# EAGLE design CircuitoClasificadorv1 (EAGLE 9.6.2)
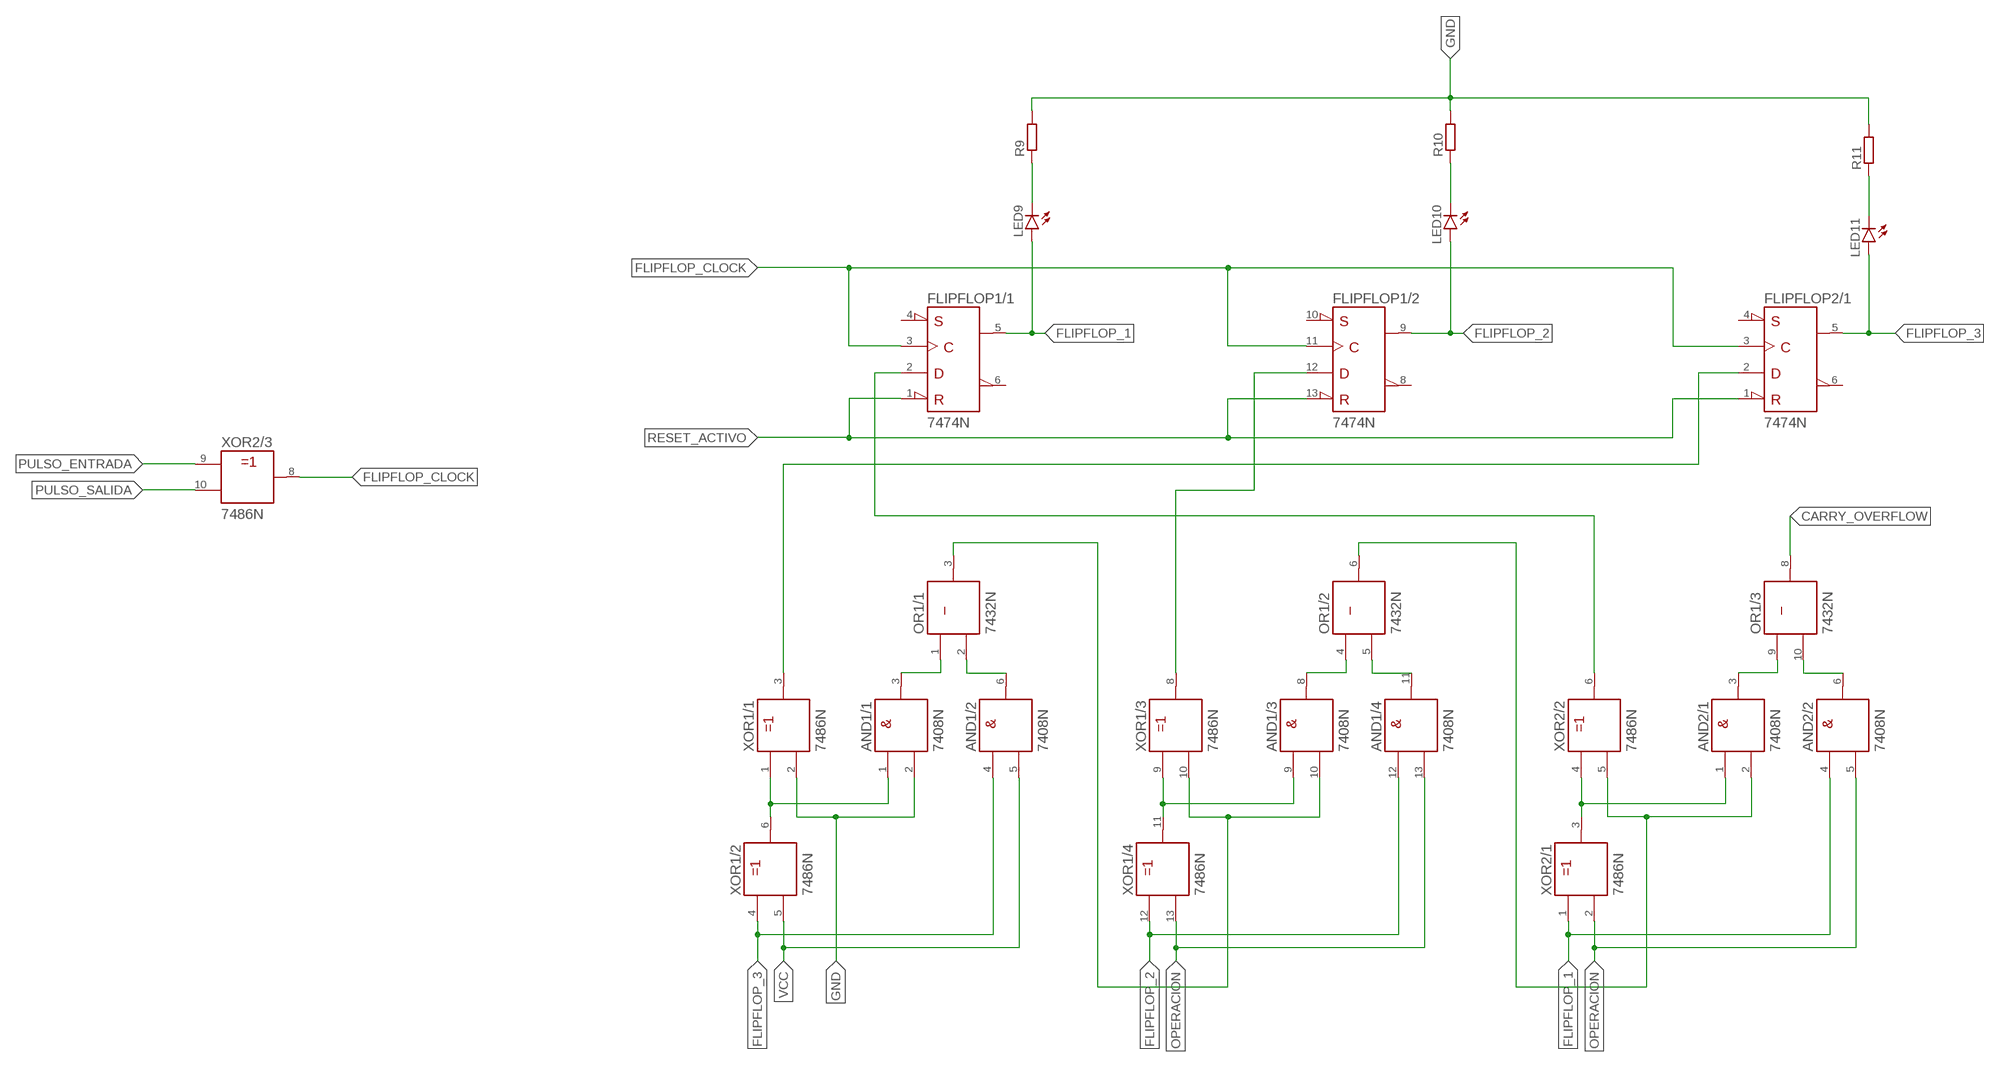
[diagram p0: schematic, sheet 1, part 1 of 2]
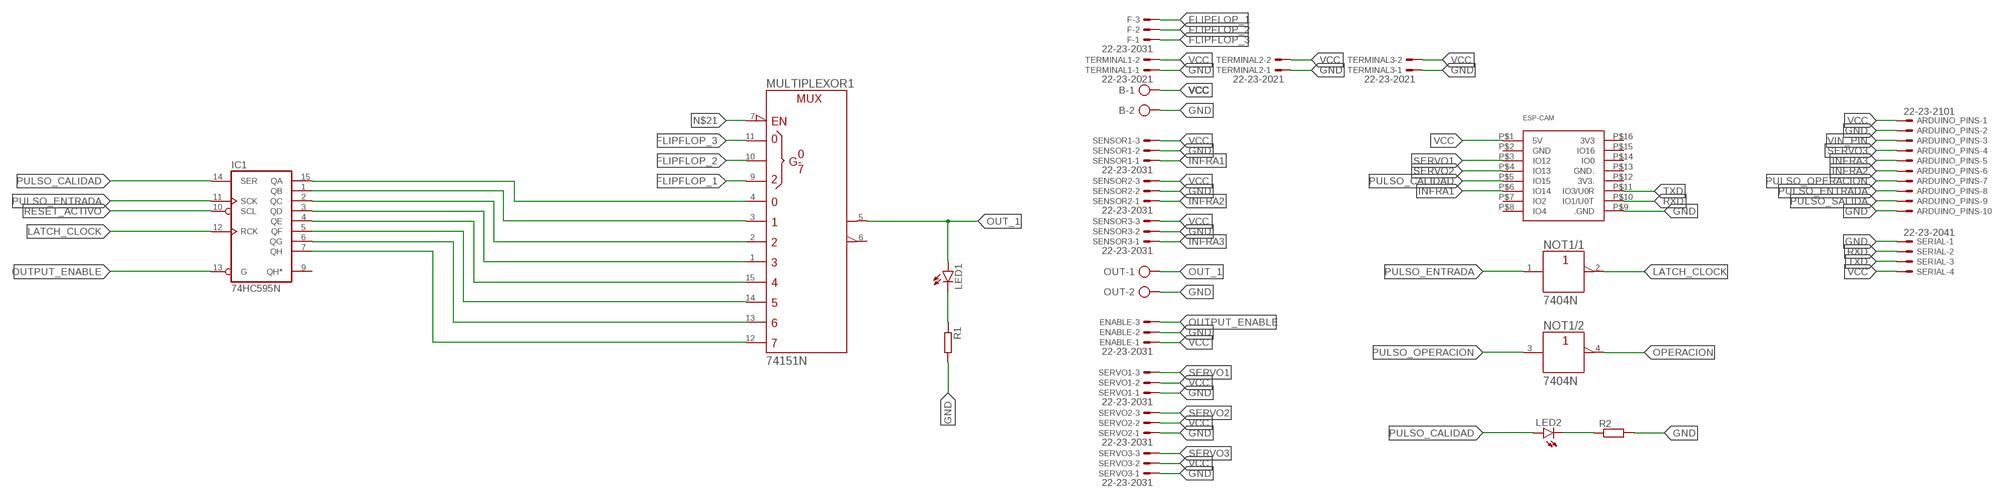
[diagram p1: schematic, sheet 1, part 2 of 2]

## Parts
AND1  7408N  [DIL14]
AND2  7408N  [DIL14]
ARDUINO_PINS  22-23-2101  [22-23-2101]
B  AK500/2  [AK500/2]
ENABLE  22-23-2031  [22-23-2031]
ESP-CAM  ESP32-CAM  [ESP32-CAM]
F  22-23-2031  [22-23-2031]
FLIPFLOP1  7474N  [DIL14]
FLIPFLOP2  7474N  [DIL14]
IC1  74HC595N  [DIL16]
LED1  LED5MM  [LED5MM]
LED2  LED5MM  [LED5MM]
LED9  LED5MM  [LED5MM]
LED10  LED5MM  [LED5MM]
LED11  LED5MM  [LED5MM]
MULTIPLEXOR1  74151N  [DIL16]
NOT1  7404N  [DIL14]
OR1  7432N  [DIL14]
OUT  AK500/2-H  [AK500/2-H]
R1  R-EU_0207/10  [0207/10]
R2  R-EU_0207/10  [0207/10]
R9  R-EU_0207/10  [0207/10]
R10  R-EU_0207/10  [0207/10]
R11  R-EU_0207/10  [0207/10]
SENSOR1  22-23-2031  [22-23-2031]
SENSOR2  22-23-2031  [22-23-2031]
SENSOR3  22-23-2031  [22-23-2031]
SERIAL  22-23-2041  [22-23-2041]
SERVO1  22-23-2031  [22-23-2031]
SERVO2  22-23-2031  [22-23-2031]
SERVO3  22-23-2031  [22-23-2031]
TERMINAL1  22-23-2021  [22-23-2021]
TERMINAL2  22-23-2021  [22-23-2021]
TERMINAL3  22-23-2021  [22-23-2021]
XOR1  7486N  [DIL14]
XOR2  7486N  [DIL14]

## Nets
CARRY_OVERFLOW: OR1.8(/3:Y)
FLIPFLOP_1: AND2.4(/2:A) F.3 FLIPFLOP1.5(/1:Q) LED9.A MULTIPLEXOR1.9(C) XOR2.1(/1:A)
FLIPFLOP_2: AND1.12(/4:A) F.2 FLIPFLOP1.9(/2:Q) LED10.A MULTIPLEXOR1.10(B) XOR1.12(/4:A)
FLIPFLOP_3: AND1.4(/2:A) F.1 FLIPFLOP2.5(/1:Q) LED11.A MULTIPLEXOR1.11(A) XOR1.4(/2:A)
FLIPFLOP_CLOCK: FLIPFLOP1.3(/1:CLK) FLIPFLOP1.11(/2:CLK) FLIPFLOP2.3(/1:CLK) XOR2.8(/3:Y)
GND: AND1.2(/1:B) ARDUINO_PINS.2 ARDUINO_PINS.10 B.2 ENABLE.2 ESP-CAM.P$9(.GND) OUT.2 R1.2 R2.2 R9.2 R10.2 R11.2 SENSOR1.2 SENSOR2.2 SENSOR3.2 SERIAL.1 SERVO1.1 SERVO2.1 SERVO3.1 TERMINAL1.1 TERMINAL2.1 TERMINAL3.1 XOR1.2(/1:B)
INFRA1: ESP-CAM.P$6(IO14) SENSOR1.1
INFRA2: ARDUINO_PINS.6 SENSOR2.1
INFRA3: ARDUINO_PINS.5 SENSOR3.1
LATCH_CLOCK: IC1.12(RCK) NOT1.2(/1:Y)
N$1: AND1.1(/1:A) XOR1.1(/1:A) XOR1.6(/2:Y)
N$2: LED2.K(C) R2.1
N$3: LED1.K(C) R1.1
N$4: AND1.6(/2:Y) OR1.2(/1:B)
N$5: FLIPFLOP2.2(/1:D) XOR1.3(/1:Y)
N$6: AND1.3(/1:Y) OR1.1(/1:A)
N$7: AND1.8(/3:Y) OR1.4(/2:A)
N$8: AND1.11(/4:Y) OR1.5(/2:B)
N$9: AND1.9(/3:A) XOR1.9(/3:A) XOR1.11(/4:Y)
N$10: AND1.10(/3:B) OR1.3(/1:Y) XOR1.10(/3:B)
N$11: AND2.3(/1:Y) OR1.9(/3:A)
N$14: AND2.6(/2:Y) OR1.10(/3:B)
N$15: AND2.1(/1:A) XOR2.3(/1:Y) XOR2.4(/2:A)
N$18: AND2.2(/1:B) OR1.6(/2:Y) XOR2.5(/2:B)
N$19: FLIPFLOP1.12(/2:D) XOR1.8(/3:Y)
N$20: FLIPFLOP1.2(/1:D) XOR2.6(/2:Y)
N$21: MULTIPLEXOR1.7(!G)
N$24: IC1.15(QA) MULTIPLEXOR1.4(D0)
N$25: IC1.1(QB) MULTIPLEXOR1.3(D1)
N$26: IC1.2(QC) MULTIPLEXOR1.2(D2)
N$27: IC1.3(QD) MULTIPLEXOR1.1(D3)
N$28: IC1.4(QE) MULTIPLEXOR1.15(D4)
N$29: IC1.5(QF) MULTIPLEXOR1.14(D5)
N$30: IC1.6(QG) MULTIPLEXOR1.13(D6)
N$31: IC1.7(QH) MULTIPLEXOR1.12(D7)
N$35: LED11.K(C) R11.1
N$36: LED10.K(C) R10.1
N$37: LED9.K(C) R9.1
OPERACION: AND1.13(/4:B) AND2.5(/2:B) NOT1.4(/2:Y) XOR1.13(/4:B) XOR2.2(/1:B)
OUT_1: LED1.A MULTIPLEXOR1.5(Y) OUT.1
OUTPUT_ENABLE: ENABLE.3 IC1.13(G)
PULSO_CALIDAD: ESP-CAM.P$5(IO15) IC1.14(SER) LED2.A
PULSO_ENTRADA: ARDUINO_PINS.8 IC1.11(SCK) NOT1.1(/1:A) XOR2.9(/3:A)
PULSO_OPERACION: ARDUINO_PINS.7 NOT1.3(/2:A)
PULSO_SALIDA: ARDUINO_PINS.9 XOR2.10(/3:B)
RESET_ACTIVO: FLIPFLOP1.1(/1:!CLR) FLIPFLOP1.13(/2:!CLR) FLIPFLOP2.1(/1:!CLR) IC1.10(SCL)
RXD: ESP-CAM.P$10(IO1/U0T) SERIAL.2
SERVO1: ESP-CAM.P$3(IO12) SERVO1.3
SERVO2: ESP-CAM.P$4(IO13) SERVO2.3
SERVO3: ARDUINO_PINS.4 SERVO3.3
TXD: ESP-CAM.P$11(IO3/U0R) SERIAL.3
VCC: AND1.5(/2:B) ARDUINO_PINS.1 B.1 ENABLE.1 ESP-CAM.P$1(5V) SENSOR1.3 SENSOR2.3 SENSOR3.3 SERIAL.4 SERVO1.2 SERVO2.2 SERVO3.2 TERMINAL1.2 TERMINAL2.2 TERMINAL3.2 XOR1.5(/2:B)
VIN_PIN: ARDUINO_PINS.3
Unconnected: AND2.8(/3:Y) AND2.9(/3:A) AND2.10(/3:B) AND2.11(/4:Y) AND2.12(/4:A) AND2.13(/4:B) ESP-CAM.P$2(GND) ESP-CAM.P$7(IO2) ESP-CAM.P$8(IO4) ESP-CAM.P$12(3V3.) ESP-CAM.P$13(GND.) ESP-CAM.P$14(IO0) ESP-CAM.P$15(IO16) ESP-CAM.P$16(3V3) FLIPFLOP1.4(/1:!PRE) FLIPFLOP1.6(/1:!Q) FLIPFLOP1.8(/2:!Q) FLIPFLOP1.10(/2:!PRE) FLIPFLOP2.4(/1:!PRE) FLIPFLOP2.6(/1:!Q) FLIPFLOP2.8(/2:!Q) FLIPFLOP2.9(/2:Q) FLIPFLOP2.10(/2:!PRE) FLIPFLOP2.11(/2:CLK) FLIPFLOP2.12(/2:D) FLIPFLOP2.13(/2:!CLR) IC1.9(QH*) MULTIPLEXOR1.6(W) NOT1.5(/3:A) NOT1.6(/3:Y) NOT1.8(/4:Y) NOT1.9(/4:A) NOT1.10(/5:Y) NOT1.11(/5:A) NOT1.12(/6:Y) NOT1.13(/6:A) OR1.11(/4:Y) OR1.12(/4:A) OR1.13(/4:B) XOR2.11(/4:Y) XOR2.12(/4:A) XOR2.13(/4:B)

## Power pins joined to a net without a drawn wire
+UB: AND1.14(/+UB:+UB) AND2.14(/+UB:+UB) FLIPFLOP1.14(/+UB:+UB) FLIPFLOP2.14(/+UB:+UB) MULTIPLEXOR1.16(+UB) NOT1.14(/+UB:+UB) OR1.14(/+UB:+UB) XOR1.14(/+UB:+UB) XOR2.14(/+UB:+UB)
-UB: AND1.7(/-UB:-UB) AND2.7(/-UB:-UB) FLIPFLOP1.7(/-UB:-UB) FLIPFLOP2.7(/-UB:-UB) MULTIPLEXOR1.8(-UB) NOT1.7(/-UB:-UB) OR1.7(/-UB:-UB) XOR1.7(/-UB:-UB) XOR2.7(/-UB:-UB)
GND: IC1.8(GND)
VCC: IC1.16(VCC)

## Library data of the parts
AND1 AND2 = 74ttl-din:74*08: Quad 2-input AND gate
ARDUINO_PINS = con-molex:22-23-2101: .100" (2.54mm) Center Header - 10 Pin; MF: MOLEX; MPN: 22-23-2101; OC_FARNELL: 1756828; OC_NEWARK: 94C0765
B = con-ptr500:AK500/2: CONNECTOR; OC_FARNELL: unknown; OC_NEWARK: unknown
ENABLE F SENSOR1-SENSOR3 SERVO1-SERVO3 = con-molex:22-23-2031: .100" (2.54mm) Center Header - 3 Pin; MF: MOLEX; MPN: 22-23-2031; OC_FARNELL: 1462950; OC_NEWARK: 30C0862
ESP-CAM = ESP32-CAM:ESP32-CAM: Check availability <https://pricing.snapeda.com/parts/ESP32-CAM/AI-Thinker/view-part?ref=eda>; AVAILABILITY: In Stock; DESCRIPTION: ESP32 ESP32 Transceiver; 802.11 a/b/g/n (Wi-Fi, WiFi, WLAN), Bluetooth® Smart 4.x Low Energy (BLE) Evaluation Board; MF: AI-Thinker; MP: ESP32-CAM; PACKAGE: None; PRICE: None; PURCHASE-URL: https://pricing.snapeda.com/search/part/ESP32-CAM/?ref=eda
FLIPFLOP1 FLIPFLOP2 = 74ttl-din:74*74: Dual D type positive edge triggered FLIP FLOP, preset and clear
IC1 = 74xx-eu:74*595: 8-bit SHIFT REGISTER, output latch
LED1 LED2 LED9-LED11 = led:LED: LED OSRAM: - CHIPLED LG R971, LG N971, LY N971, LG Q971, LY Q971, LO R971, LY R971 LH N974, LH R974 LS Q976, LO Q976, LY Q976 LO Q996 - Hyper CHIPLED LW Q18S LB Q993, LB Q99A, LB R99A - SideLED LS A670, LO A670, LY A670, LG A670, LP A670 LB A673, LV A673, LT A673, LW A673 LH A674 LY A675 LS A676, LA A676, LO A676, LY A676, LW A676 LS A679, LY A679, LG A679 - Hyper Micro SIDELED® LS Y876, LA Y876, LO Y876, LY Y876 LT Y87S - SmartLED LW L88C, LW L88S LB L89C, LB L89S, LG L890 LS L89K, LO L89K, LY L89K LS L896, LA L896, LO L896, LY L896 - TOPLED LS T670, LO T670, LY T670, LG T670, LP T670 LSG T670, LSP T670, LSY T670, LOP T670, LYG T670 LG T671, LOG T671, LSG T671 LB T673, LV T673, LT T673, LW T673 LH T674 LS T676, LA T676, LO T676, LY T676, LB T676, LH T676, LSB T676, LW T676 LB T67C, LV T67C, LT T67C, LS T67K, LO T67K, LY T67K, LW E67C LS E67B, LA E67B, LO E67B, LY E67B, LB E67C, LV E67C, LT E67C LW T67C LS T679, LY T679, LG T679 LS T770, LO T770, LY T770, LG T770, LP T770 LB T773, LV T773, LT T773, LW T773 LH T774 LS E675, LA E675, LY E675, LS T675 LS T776, LA T776, LO T776, LY T776, LB T776 LHGB T686 LT T68C, LB T68C - Hyper Mini TOPLED® LB M676 - Mini TOPLED Santana® LG M470 LS M47K, LO M47K, LY M47K Source: http://www.osram.convergy.de LUXEON: - LUMILED® LXK2-PW12-R00, LXK2-PW12-S00, LXK2-PW14-U00, LXK2-PW14-V00 LXK2-PM12-R00, LXK2-PM12-S00, LXK2-PM14-U00 LXK2-PE12-Q00, LXK2-PE12-R00, LXK2-PE12-S00, LXK2-PE14-T00, LXK2-PE14-U00 LXK2-PB12-K00, LXK2-PB12-L00, LXK2-PB12-M00, LXK2-PB14-N00, LXK2-PB14-P00, LXK2-PB14-Q00 LXK2-PR12-L00, LXK2-PR12-M00, LXK2-PR14-Q00, LXK2-PR14-R00 LXK2-PD12-Q00, LXK2-PD12-R00, LXK2-PD12-S00 LXK2-PH12-R00, LXK2-PH12-S00 LXK2-PL12-P00, LXK2-PL12-Q00, LXK2-PL12-R00 Source: www.luxeon.com KINGBRIGHT: KA-3528ASYC Source: www.kingbright.com
MULTIPLEXOR1 = 74ttl-din:74*151: Data SELECTOR/MULTIPLEXER
NOT1 = 74ttl-din:74*04: Hex INVERTER
OR1 = 74ttl-din:74*32: Quad 2-input OR gate
OUT = con-ptr500:AK500/2-H: CONNECTOR Aug. 2004 / PTR Meßtechnik: Die Bezeichnung der Serie AK505 wurde geändert. Es handelt sich hierbei um AK500 in horizontaler Ausführung.; OC_FARNELL: unknown; OC_NEWARK: unknown
R1 R2 R9-R11 = rcl:R-EU_: RESISTOR, European symbol; SPICEPREFIX: R
SERIAL = con-molex:22-23-2041: .100" (2.54mm) Center Header - 4 Pin; MF: MOLEX; MPN: 22-23-2041; OC_FARNELL: 1462920; OC_NEWARK: 38C0355
TERMINAL1-TERMINAL3 = con-molex:22-23-2021: .100" (2.54mm) Center Header - 2 Pin; MF: MOLEX; MPN: 22-23-2021; OC_FARNELL: 1462926; OC_NEWARK: 25C3832
XOR1 XOR2 = 74ttl-din:74*86: Quad 2-input EXCLUSIV-OR gate

## Board
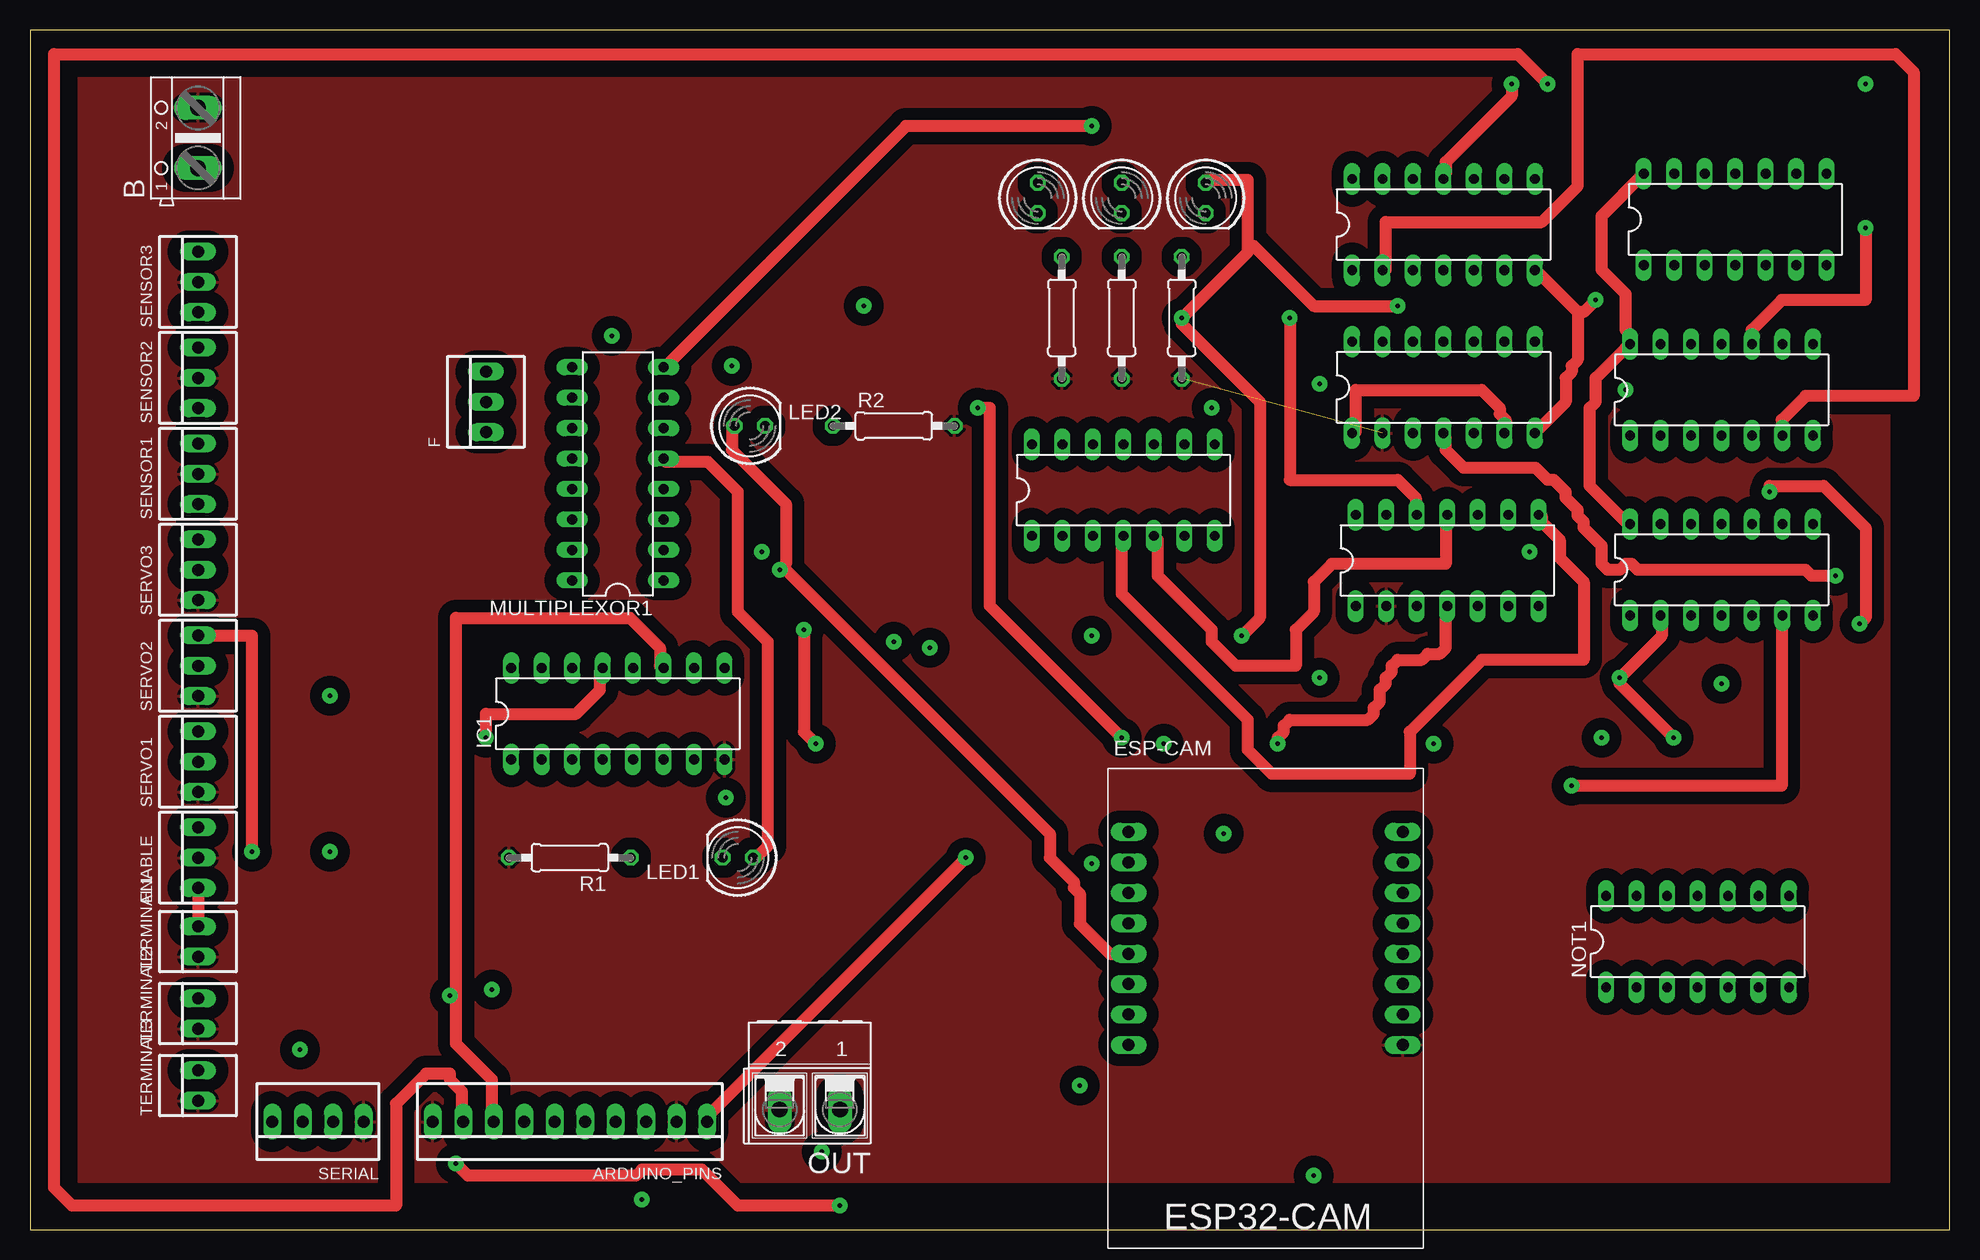
[diagram p2: board, top side]
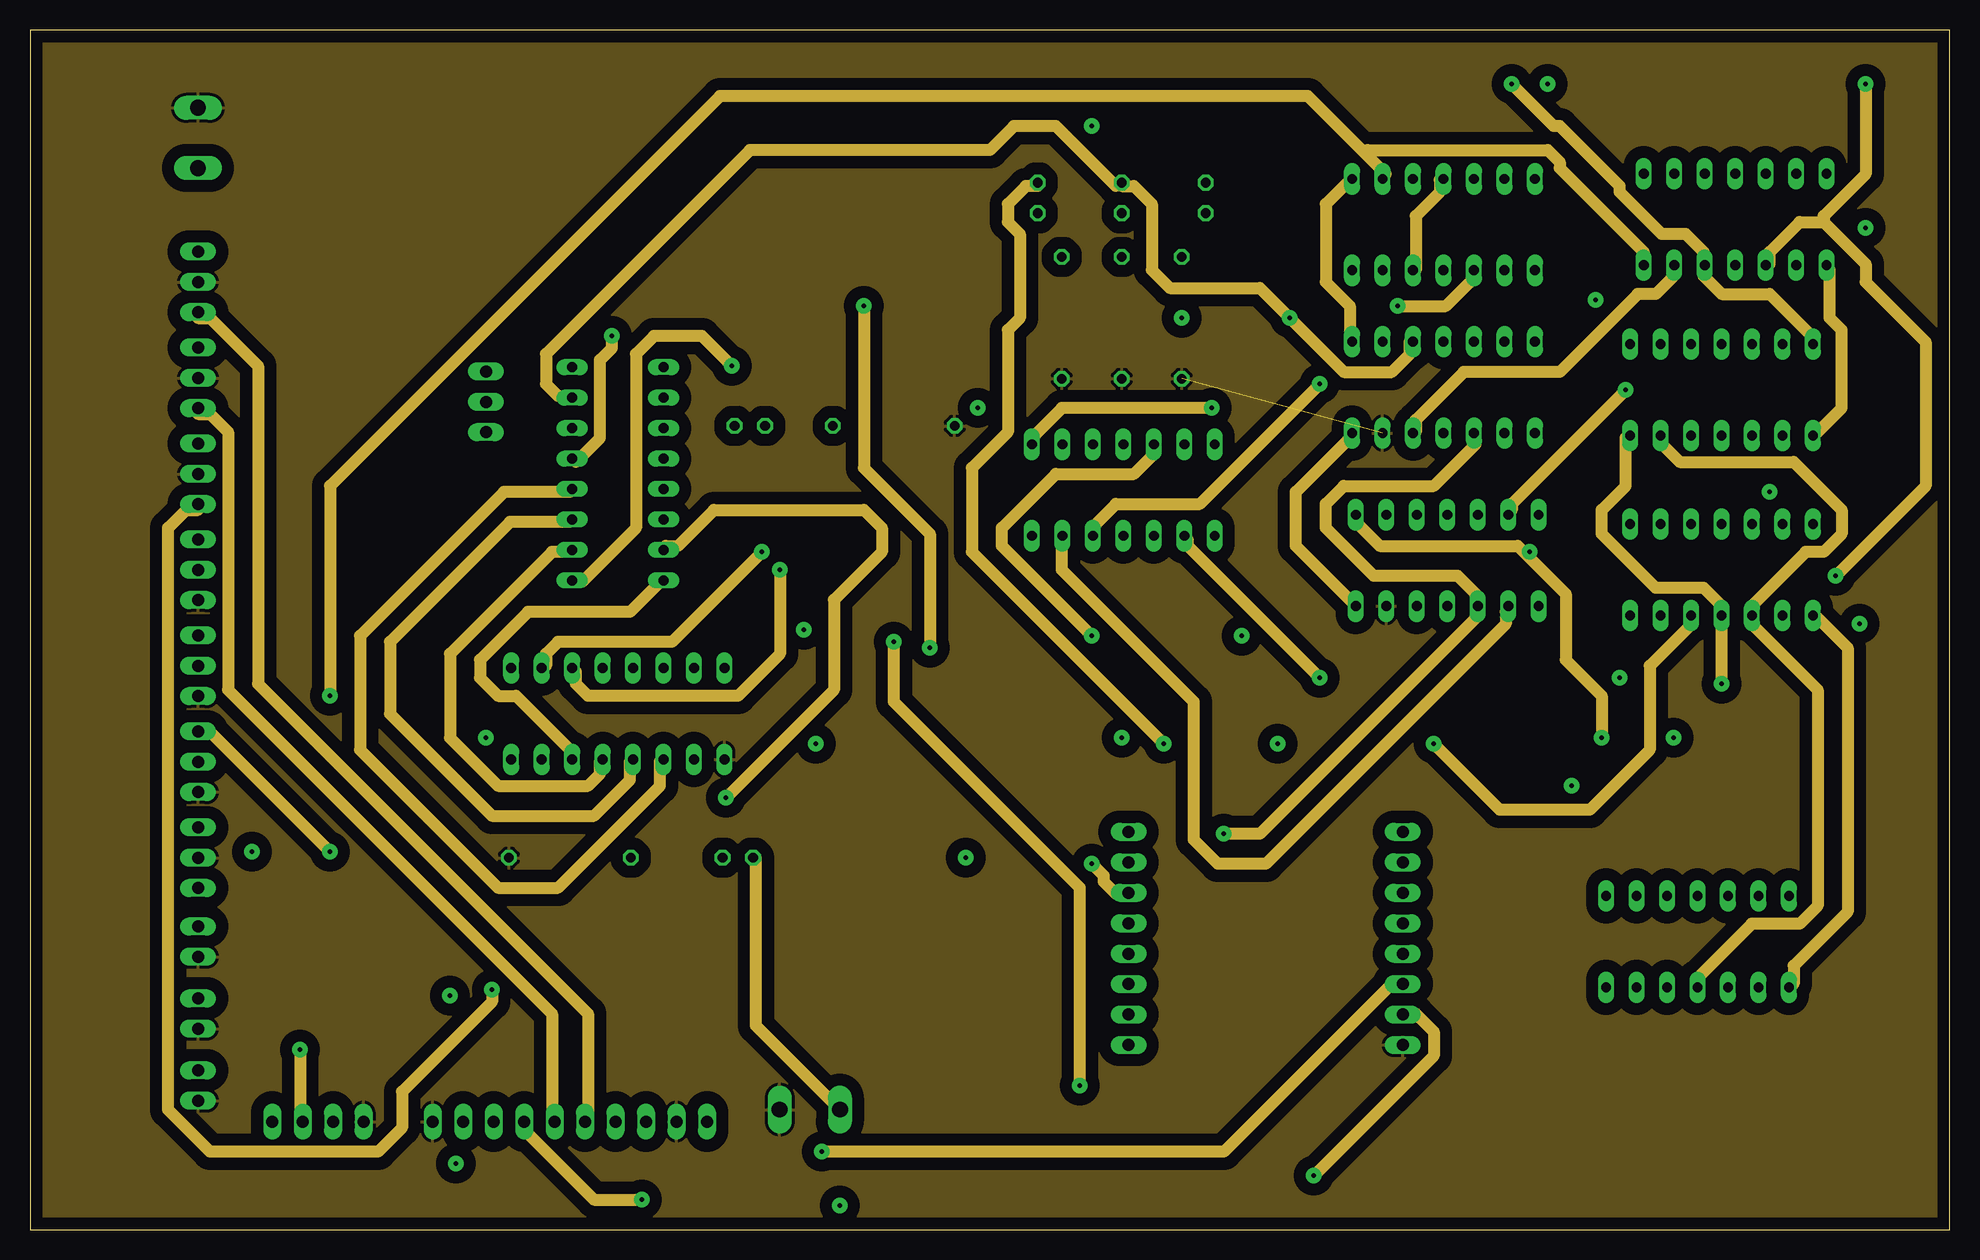
[diagram p3: board, inner layer Route2]
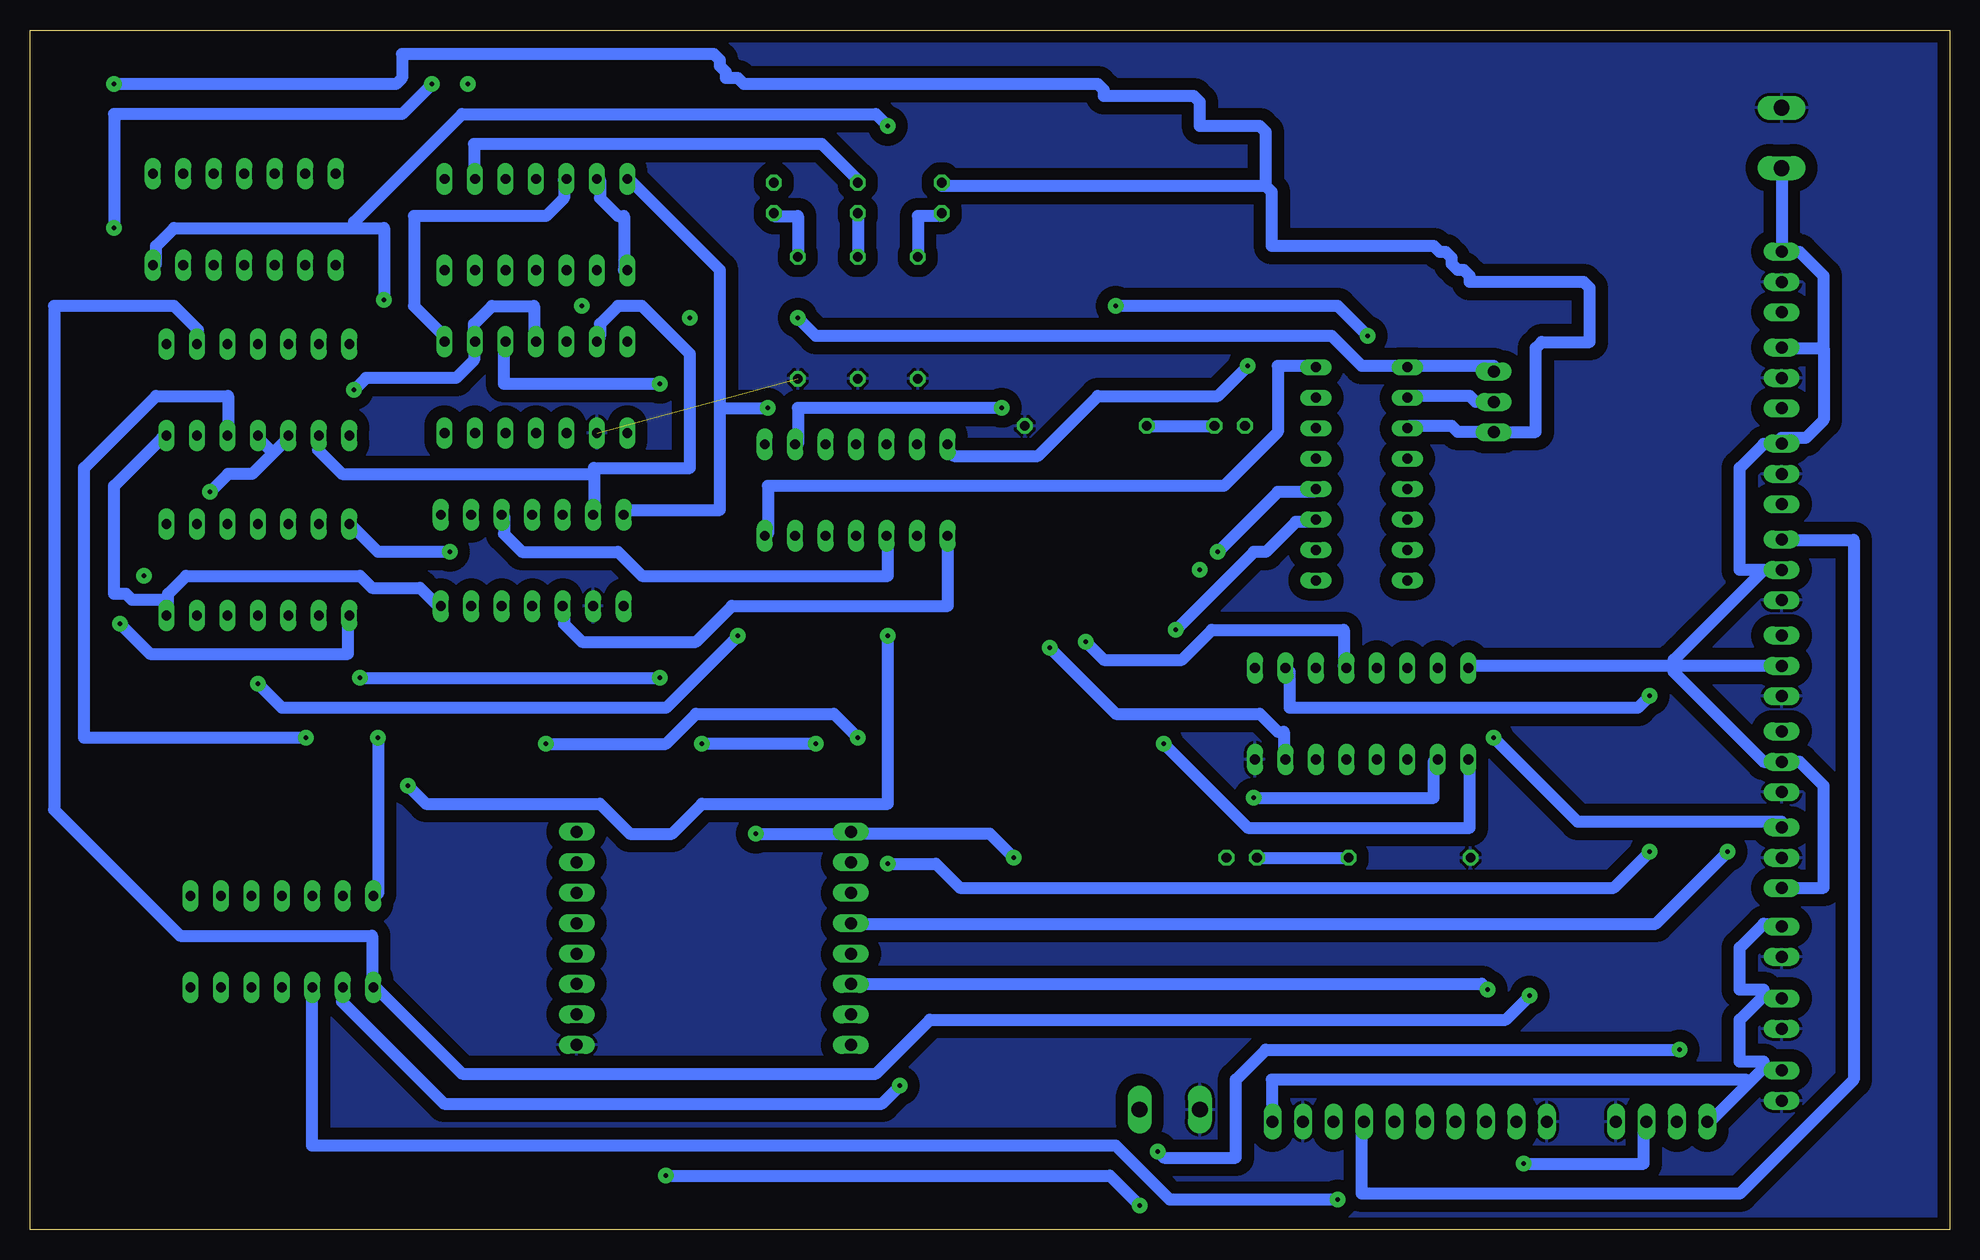
[diagram p4: board, bottom side, seen from below]

Size 160 x 100 mm. Coordinates in mm from the lower left corner, seen from the top.
Outline: 0,0 160,0 160,100 0,100 0,0
Copper layers (1+2*15+16): Top 0.035mm / dielectric 1.5mm / Route2 0.035mm / dielectric 0.15mm / Route15 0.035mm / dielectric 0.2mm / Bottom 0.035mm
Design rules "default *": minimum track width 40mil, minimum drill 0.35mm, track to track 40mil, track to pad 40mil, pad to pad 40mil, via to via 40mil, smd to smd 10mil, copper to edge 40mil, drill to drill 6mil, minimum pad ring 10mil, minimum via ring 18mil, stop-mask expansion 4mil, vias tented up to drill 0mil, thermal gap 10mil

### Footprints (pad centres in the part's own frame; a part is rotated, then mirrored left to right if it is on the bottom)
DIL14 = drill 0.813 long: 1 -7.62,-3.81; 2 -5.08,-3.81; 3 -2.54,-3.81; 4 0,-3.81; 5 2.54,-3.81; 6 5.08,-3.81; 7 7.62,-3.81; 8 7.62,3.81; 9 5.08,3.81; 10 2.54,3.81; 11 0,3.81; 12 -2.54,3.81; 13 -5.08,3.81; 14 -7.62,3.81
22-23-2101 = drill 1 long: 1 -11.43,0; 2 -8.89,0; 3 -6.35,0; 4 -3.81,0; 5 -1.27,0; 6 1.27,0; 7 3.81,0; 8 6.35,0; 9 8.89,0; 10 11.43,0
AK500/2 = drill 1.321 long: 1 -2.515,0; 2 2.515,0
22-23-2031 = drill 1 long: 1 -2.54,0; 2 0,0; 3 2.54,0
ESP32-CAM = drill 1 pad 1.422 long: P$1 -11.43,10.16; P$2 -11.43,7.62; P$3 -11.43,5.08; P$4 -11.43,2.54; P$5 -11.43,0; P$6 -11.43,-2.54; P$7 -11.43,-5.08; P$8 -11.43,-7.62; P$9 11.43,-7.62; P$10 11.43,-5.08; P$11 11.43,-2.54; P$12 11.43,0; P$13 11.43,2.54; P$14 11.43,5.08; P$15 11.43,7.62; P$16 11.43,10.16
DIL16 = drill 0.813 long: 1 -8.89,-3.81; 2 -6.35,-3.81; 3 -3.81,-3.81; 4 -1.27,-3.81; 5 1.27,-3.81; 6 3.81,-3.81; 7 6.35,-3.81; 8 8.89,-3.81; 9 8.89,3.81; 10 6.35,3.81; 11 3.81,3.81; 12 1.27,3.81; 13 -1.27,3.81; 14 -3.81,3.81; 15 -6.35,3.81; 16 -8.89,3.81
LED5MM = drill 0.813 octagon: A -1.27,0; K 1.27,0
AK500/2-H = drill 1.321 long: 1 -2.515,0; 2 2.515,0
0207/10 = drill 0.813 octagon: 1 -5.08,0; 2 5.08,0
22-23-2041 = drill 1 long: 1 -3.81,0; 2 -1.27,0; 3 1.27,0; 4 3.81,0
22-23-2021 = drill 1 long: 1 -1.27,0; 2 1.27,0

### Placement (x,y rotation side)
AND1  118.14,55.78 0 top
AND2  141,55 0 top
ARDUINO_PINS  45,9 180 top
B  14,91 90 top
ENABLE  14,31 90 top
ESP-CAM  103,23 0 top
F  38,69 90 top
FLIPFLOP1  117.82,83.78 0 top
FLIPFLOP2  142.14,84.21 0 top
IC1  49,43 0 top
LED1  59,31 180 top
LED2  60,67 0 top
LED9  98,86 270 top
LED10  91,86 270 top
LED11  84,86 270 top
MULTIPLEXOR1  49,63 90 top
NOT1  139,24 0 top
OR1  91.14,61.64 0 top
OUT  65,10 180 top
R1  45,31 180 top
R2  72,67 0 top
R9  96,76 270 top
R10  91,76 270 top
R11  86,76 270 top
SENSOR1  14,63 90 top
SENSOR2  14,71 90 top
SENSOR3  14,79 90 top
SERIAL  24,9 180 top
SERVO1  14,39 90 top
SERVO2  14,47 90 top
SERVO3  14,55 90 top
TERMINAL1  14,24 90 top
TERMINAL2  14,18 90 top
TERMINAL3  14,12 90 top
XOR1  117.82,70.21 0 top
XOR2  141,70 0 top

### Tracks (layer width: path | path; a pad name or v marks a point on that pad's centre or on a via)
+UB  (via drill 0.35)
  Top 1.016: AND2.14 133,59 130,62 130,68.5 130.5,69 130.5,71 133,73.5 XOR2.14 133.5,74 133.5,74.5 133,75 133,78 131,80 131,84.5 FLIPFLOP2.14
  Route2 1.016: v58.5,72 56,74.5 52,74.5 50.5,73 50.5,58.5 46,54 45.5,54 MULTIPLEXOR1.16 | XOR1.14 110,74.5 110,77 108,79 108,85.5 110,87.5 FLIPFLOP1.14 | v131,41 131,44.5 128,47.5 128,53 124.75,56.25 | 124.75,56.25 124,57 112.5,57 110.5,59 110.5,59.5 AND1.14 | v125,56.5 124.75,56.25 | v98.5,68.5 86,68.5 83.5,66 83.5,65.5 OR1.14
  Bottom 1.016: v58.5,72 61,69.5 71,69.5 76,64.5 83,64.5 83.5,65 OR1.14 | v131,41 131,28 NOT1.14 | v125,56.5 131,56.5 133,58.5 AND2.14 | 102.5,68.5 102.5,60 110.5,60 AND1.14 | 102.5,68.5 102.5,80 110,87.5 FLIPFLOP1.14 | 102.5,68.5 v98.5,68.5
-UB  (via drill 0.35)
  Top 1.016: 129,76.5 129,72.5 128.5,72 128.5,71.5 128,71 128,69 125.5,66.5 XOR1.7 | 129,76.5 125.5,80 FLIPFLOP1.7 | v130.5,77.5 129.5,76.5 129,76.5 | v88.5,92 73,92 53,72 MULTIPLEXOR1.8
  Route2 1.016: NOT1.7 147,20.5 147,22 151.5,26.5 151.5,48.5 149,51 AND2.7 | FLIPFLOP2.7 150,80 150,76 151,75 151,68.5 149,66.5 XOR2.7
  Bottom 1.016: OR1.7 98.5,58 98.5,62 60.5,62 56,66.5 56,72 53,72 MULTIPLEXOR1.8 | 148.5,52.5 148.5,51.5 AND2.7 | 148.5,52.5 148.5,53 147,54.5 132.5,54.5 131.5,53.5 127.5,53.5 126,52 AND1.7 | 148.5,52.5 151.5,52.5 152,53 153,53 153,62 149,66 XOR2.7 | v130.5,77.5 130.5,83.5 133,83.5 | 133,83.5 148,83.5 149.5,82 149.5,80.5 FLIPFLOP2.7 | v88.5,92 89.5,93 124,93 133,84 133,83.5
FLIPFLOP_1  (via drill 0.35)
  Top 1.016: 101.5,82 101.5,81.5 v96,76 96,75.5 102.5,69 102.5,51 v101,49.5 | 101.5,82 101.5,87.5 98,87.5 LED9.A | v114,77 107,77 102,82 101.5,82
  Route2 1.016: XOR2.1 133,66 133,62 131,60 131,58 135.5,53.5 139.5,53.5 141,52 AND2.4 v141,45.5 | v114,77 118,77 120.5,79.5 FLIPFLOP1.5
  Bottom 1.016: F.3 38,72 45,72 MULTIPLEXOR1.9 45.5,72 49,72 51.5,74.5 94.5,74.5 v96,76 | v141,45.5 139,43.5 107,43.5 v101,49.5
FLIPFLOP_2  (via drill 0.35)
  Top 1.016: v105,76 105,62.5 114,62.5 115.5,61 115.5,60 AND1.12
  Route2 1.016: XOR1.12 115,74 115,73 113.5,71.5 109.5,71.5 v105,76 102.5,78.5 95,78.5 93.5,80 93.5,85.5 92,87 91,87 LED10.A 90.5,87 85.5,92 82,92 80,90 60,90 43,73 43,70.5 44,69.5 45,69.5 MULTIPLEXOR1.10
  Bottom 1.016: F.2 39.5,69 40,69.5 45,69.5 MULTIPLEXOR1.10 | FLIPFLOP1.9 123,88 123,90.5 94,90.5 91,87.5 LED10.A
FLIPFLOP_3  (via drill 0.35)
  Top 1.016: v150.5,54.5 148.5,54.5 148,55 134,55 133.5,55.5 133,55.5 132.5,55 131.5,55 131,55.5 131,57 129.5,58.5 129.5,59 129,59.5 129,60 128,61 128,61.5 127,62.5 126.5,62.5 125.5,63.5 119.5,63.5 118,65 118,66 XOR1.4 | v104,40.5 104,41 104.5,41.5 104.5,42 105,42.5 111.5,42.5 112,43 112,43.5 112.5,44 112.5,45 113,45.5 113,46 113.5,46.5 113.5,47 114,47.5 116,47.5 116.5,48 117.5,48 118,48.5 118,51.5 AND1.4
  Route2 1.016: v150.5,54.5 158,62 158,74 153,79 153,80.5 149.5,84 | 149.5,84 147.5,84 145,81.5 145,80.5 FLIPFLOP2.5 | v94.5,40.5 78.5,56.5 78.5,63.5 81.5,66.5 81.5,75 82.5,76 82.5,83 81.5,84 81.5,85.5 83,87 84,87 LED11.A | v153,95.5 153,88 149.5,84.5 149.5,84
  Bottom 1.016: MULTIPLEXOR1.11 45,67 41.5,67 41,66.5 38,66.5 F.1 37.5,66.5 34.5,66.5 34.5,73.5 34,74 30,74 30,78.5 30.5,79 40,79 40,79.5 40.5,80 41,80 41.5,80.5 41.5,81 42,81.5 42.5,81.5 43,82 56.5,82 56.5,86.5 57,87 | 57,87 84,87 LED11.A | v94.5,40.5 v104,40.5 | v153,95.5 129.5,95.5 129,96 129,98 103,98 102.5,97.5 102.5,97 102,96.5 102,96 101,96 100.5,95.5 71,95.5 70.5,95 70.5,94.5 63,94.5 62.5,94 62.5,92 57.5,92 57,91.5 57,87
FLIPFLOP_CLOCK  (via drill 0.35)
  Top 1.016: v123.5,95.5 123.5,94.5 118,89 118,88 FLIPFLOP1.11
  Route2 1.016: FLIPFLOP1.3 115.5,80 115.5,84.5 117.5,86.5 117.5,87.5 FLIPFLOP1.11 | XOR2.8 148.5,74 148.5,74.5 145,78 141,78 139.5,79.5 139.5,80 FLIPFLOP2.3 139.5,80.5 139.5,81.5 138,83 136,83 132.5,86.5 132.5,87 127.5,92 127,92 v123.5,95.5
GND  (1 unrouted)
  pour Top: 4,96 4,4 155,4 155,96
  pour Bottom: 0,100 160,100 160,0 0,0
  pour Route2: 0,100 160,100 160,0 0,0
INFRA1  (via drill 0.35)
  Route2 1.016: v38.5,20 38.5,19 31,11.5 31,8.5 29,6.5 15,6.5 11.5,10 11.5,58.5 13,60 14,60 SENSOR1.1
  Bottom 1.016: v38.5,20 39,20.5 91.5,20.5 ESP-CAM.P$6
INFRA2
  Route2 1.016: ARDUINO_PINS.6 43.5,9 43.5,18 16.5,45 16.5,66.5 15,68 14,68 SENSOR2.1
INFRA3
  Route2 1.016: ARDUINO_PINS.5 46.5,9 46.5,18 19,45.5 19,72 15,76 14,76 SENSOR3.1
LATCH_CLOCK  (via drill 0.35)
  Route2 1.016: v72,49 72,44 87.5,28.5 v87.5,12
  Bottom 1.016: v72,49 70.5,47.5 64,47.5 61.5,50 50.5,50 50.5,47 IC1.12 | v87.5,12 89,10.5 125.5,10.5 134,19 134,20 NOT1.2
N$1
  Top 1.016: XOR1.6 123,66.5 123,67.5 122.5,68 122.5,68.5 121,70 110.5,70 110.5,66.5 XOR1.1
  Route2 1.016: XOR1.1 110,66 105.5,61.5 105.5,57 110.5,52 AND1.1
N$2
  Bottom 1.016: R2.1 LED2.K
N$3
  Bottom 1.016: LED1.K R1.1
N$4
  Route2 1.016: OR1.2 86,57.5 86,55 97,44 97,32.5 99,30.5 103,30.5 123,50.5 123,51.5 AND1.6
N$5
  Route2 1.016: XOR1.3 115.5,66.5 115.5,67.5 119.5,71.5 127.5,71.5 134,78 135.5,78 137,79.5 137,80 FLIPFLOP2.2
N$6
  Bottom 1.016: OR1.1 83.5,57.5 83.5,52 101.5,52 104.5,49 114,49 115.5,50.5 115.5,51.5 AND1.3
N$7
  Top 1.016: OR1.4 91,57.5 91,53 101.5,42.5 101.5,40 103.5,38 115,38 115,41.5 121,47.5 129.5,47.5 129.5,54 127.5,56 127.5,57.5 126,59 126,59.5 AND1.8
N$8
  Top 1.016: OR1.5 94,57.5 94,54.5 98.5,50 98.5,49 100.5,47 105.5,47 105.5,50 107,51.5 107,54 108.5,55.5 118,55.5 118,59.5 AND1.11
N$9  (via drill 0.35)
  Route2 1.016: v133,70 123.5,60.5 123.5,60 AND1.9
  Bottom 1.016: XOR1.11 118,74.5 118,77 121.5,77 123,75.5 123,74.5 XOR1.9 123,73.5 123,72.5 124.5,71 132,71 v133,70
N$10  (via drill 0.35)
  Route2 1.016: v107.5,70.5 97.5,60.5 90.5,60.5 88.5,58.5 88.5,58 OR1.3
  Bottom 1.016: OR1.3 88.5,57.5 88.5,54.5 109,54.5 111,56.5 119,56.5 120.5,58 120.5,59.5 AND1.10 | v107.5,70.5 120.5,70.5 120.5,74 XOR1.10
N$11  (via drill 0.35)
  Top 1.016: v79,68.5 80,68.5 80,52 v91,41
  Route2 1.016: v117,40.5 122.5,35 130,35 135,40 135,47 138.5,50.5 138.5,51 AND2.3
  Bottom 1.016: v79,68.5 96,68.5 96,65.5 OR1.9 | v91,41 93,43 104.5,43 107,40.5 v117,40.5
N$14  (via drill 0.35)
  Top 1.016: v128.5,37 146,37 146,51 AND2.6
  Route2 1.016: v88.5,49.5 81,57 81,58.5 85.5,63 92,63 93.5,64.5 93.5,65 OR1.10
  Bottom 1.016: v88.5,49.5 88.5,35.5 104,35.5 106.5,33 110,33 112.5,35.5 127,35.5 v128.5,37
N$15  (via drill 0.35)
  Top 1.016: v152.5,50.5 153,51 153,58.5 149.5,62 145,62 v145,61.5
  Bottom 1.016: v152.5,50.5 150,48 133.5,48 133.5,51 AND2.1 | v145,61.5 143.5,63 141.5,63 139.75,64.75 | 139.75,64.75 138.5,66 XOR2.3 | 139.75,64.75 141,66 XOR2.4
N$18  (via drill 0.35)
  Top 1.016: AND2.2 136,51 136,49.5 v132.5,46 132.5,45.5 v137,41
  Route2 1.016: v107.5,46 96.5,57 96.5,57.5 OR1.6
  Bottom 1.016: v132.5,46 v107.5,46 | v137,41 155.5,41 155.5,63.5 149.5,69.5 143.5,69.5 143.5,66.5 XOR2.5
N$19
  Bottom 1.016: XOR1.8 125.5,74.5 128,77 128,84.5 117,84.5 115.5,86 115.5,87.5 FLIPFLOP1.12
N$20
  Top 1.016: XOR2.6 146,66.5 146,67.5 148,69.5 157,69.5 157,96.5 155.5,98 129,98 129,87 126,84 113,84 113,80 FLIPFLOP1.2
N$24  (via drill 0.35)
  Route2 1.016: v61,56.5 53.5,49 44,49 43,48 43,47 IC1.15
  Bottom 1.016: v61,56.5 56,61.5 53,61.5 MULTIPLEXOR1.4
N$25  (via drill 0.35)
  Top 1.016: v65.5,40.5 64.5,41.5 v64.5,50
  Bottom 1.016: v65.5,40.5 58.5,33.5 40,33.5 40,39 IC1.1 | v64.5,50 58,56.5 57,56.5 54.5,59 53,59 MULTIPLEXOR1.3
N$26  (via drill 0.35)
  Route2 1.016: v58,36 67,45 67,52.5 71,56.5 71,58.5 69.5,60 57,60 54,57 53,57 MULTIPLEXOR1.2
  Bottom 1.016: v58,36 43,36 43,39 IC1.2
N$27
  Route2 1.016: IC1.3 45,39.5 45,40 40.5,44.5 39,44.5 37.5,46 37.5,47.5 41.5,51.5 50,51.5 52.5,54 MULTIPLEXOR1.1
N$28
  Route2 1.016: IC1.4 47.5,39 47.5,38 46.5,37 39,37 35,41 35,48 43.5,56.5 45,56.5 MULTIPLEXOR1.15
N$29
  Route2 1.016: IC1.5 50,39 50,37.5 47,34.5 38.5,34.5 30,43 30,49 40,59 45,59 MULTIPLEXOR1.14
N$30
  Route2 1.016: IC1.6 52.5,39 52.5,37 44,28.5 39,28.5 27.5,40 27.5,49.5 39.5,61.5 45,61.5 MULTIPLEXOR1.13
N$31  (via drill 0.35)
  Route2 1.016: v75,48.5 75,58 69.5,63.5 v69.5,77 | v48.5,74.5 48.5,73.5 47.5,72.5 47.5,66 45.5,64 MULTIPLEXOR1.12
  Bottom 1.016: v75,48.5 69.5,43 57.5,43 56,41.5 55.5,41.5 55.5,39.5 IC1.7 | v69.5,77 51,77 v48.5,74.5
N$35
  Bottom 1.016: R11.1 86,84.5 84,84.5 LED11.K
N$36
  Bottom 1.016: LED10.K R10.1
N$37
  Bottom 1.016: R9.1 96,84.5 98,84.5 LED9.K
OPERACION
  Route2 1.016: NOT1.4 139,21 143.5,25.5 147.5,25.5 149,27 149,45 143.5,50.5 143.5,51 AND2.5 143.5,51.5 143.5,52 148,56.5 149.5,56.5 151,58 151,60 147,64 137.5,64 136,65.5 136,66 XOR2.2
  Bottom 1.016: 113,63 113,60 AND1.13 | 113,63 134,63 136,65 136,66 XOR2.2 | XOR1.13 112.5,74.5 112.5,75.5 111,77 109,77 105,73 105,63.5 113,63.5 113,63
OUT_1
  Top 1.016: MULTIPLEXOR1.5 53,64 56.5,64 59,61.5 59,51.5 61.5,49 61.5,32 60.5,31 LED1.A
  Route2 1.016: LED1.A 60.5,31 60.5,17 OUT.1
OUTPUT_ENABLE  (via drill 0.35)
  Top 1.016: v38,41 38,43 45.5,43 47.5,45 47.5,46.5 IC1.13
  Bottom 1.016: v38,41 31,34 14,34 ENABLE.3
PULSO_CALIDAD  (via drill 0.35)
  Top 1.016: 62.75,55.25 63,55.5 63,60.5 58.5,65 58.5,67 LED2.A | 62.75,55.25 v62.5,55 | ESP-CAM.P$5 90,23 87.5,25.5 87.5,28 87,28.5 87,29 85,31 85,33 62.75,55.25
  Route2 1.016: v62.5,55 62.5,48 59,44.5 46.5,44.5 45.5,45.5 45.5,46.5 IC1.14
PULSO_ENTRADA  (via drill 0.35)
  Top 1.016: 35.5,19.5 35.5,15.5 38.5,12.5 38.5,9 ARDUINO_PINS.8 | 35.5,19.5 35.5,51 50,51 52.5,48.5 52.5,47 IC1.11 | v35,19.5 35.5,19.5
  Bottom 1.016: XOR2.9 146,74 146,75 148,77 158,77 158,35 147.5,24.5 131.5,24.5 131.5,20.5 NOT1.1 131,20 124,13 89.5,13 85,17.5 37,17.5 v35,19.5
PULSO_OPERACION  (via drill 0.35)
  Route2 1.016: v51,2.5 47,2.5 41,8.5 41,9 ARDUINO_PINS.7
  Bottom 1.016: v51,2.5 65,2.5 69.5,7 136.5,7 136.5,20 NOT1.3
PULSO_SALIDA  (via drill 0.35)
  Top 1.016: v153,83.5 153,77.5 146,77.5 143.5,75 143.5,74 XOR2.10 | v126.5,95.5 124,98 2,98 2,3.5 3.5,2 30.5,2 30.5,10.5 33,13 35,13 35,12.5 36,11.5 36,9 ARDUINO_PINS.9
  Bottom 1.016: v153,83.5 153,93 129,93 v126.5,95.5
RESET_ACTIVO  (via drill 0.35)
  Route2 1.016: v25,44.5 25,62 57.5,94.5 106.5,94.5 111.25,89.75 | 111.25,89.75 113,88 FLIPFLOP1.13 | FLIPFLOP2.1 134.5,80.5 134.5,81.5 127.5,88.5 127.5,89 126.5,90 111.5,90 111.25,89.75
  Bottom 1.016: v25,44.5 26,43.5 55,43.5 55,46.5 IC1.10 | FLIPFLOP1.1 110.5,80 110.5,84.5 111,84.5 112.5,86 112.5,87.5 FLIPFLOP1.13
RXD  (via drill 0.35)
  Top 1.016: v35.5,5.5 36.5,4.5 50.5,4.5 51,5 56,5 59,2 v67.5,2
  Route2 1.016: v107,4.5 117,14.5 117,16.5 115.5,18 114.5,18 ESP-CAM.P$10
  Bottom 1.016: v35.5,5.5 25.5,5.5 25.5,9 SERIAL.2 | v67.5,2 70,4.5 v107,4.5
SERVO1  (via drill 0.35)
  Route2 1.016: v25,31.5 15,41.5 14,41.5 SERVO1.3 | v88.5,30.5 89.5,29.5 89.5,29 90.5,28 91.5,28 ESP-CAM.P$3
  Bottom 1.016: v25,31.5 28,28.5 82.5,28.5 84.5,30.5 v88.5,30.5
SERVO2  (via drill 0.35)
  Top 1.016: v18.5,31.5 18.5,49.5 14,49.5 SERVO2.3
  Bottom 1.016: v18.5,31.5 24.5,25.5 91.5,25.5 ESP-CAM.P$4
SERVO3
  Bottom 1.016: ARDUINO_PINS.4 49,9 49,3 17.5,3 8,12.5 8,57.5 14,57.5 SERVO3.3
TXD  (via drill 0.35)
  Route2 1.016: v22.5,15 22.5,9 SERIAL.3 | v66,6.5 99.5,6.5 113.5,20.5 114,20.5 ESP-CAM.P$11
  Bottom 1.016: v22.5,15 57,15 59.5,12.5 59.5,6 65.5,6 v66,6.5
VCC  (via drill 0.35)
  Top 1.016: ENABLE.1 TERMINAL1.2 | v78,31 56.5,9.5 56.5,9 ARDUINO_PINS.1
  Route2 1.016: XOR1.5 120.5,66 120.5,65.5 117,62 109.5,62 108,60.5 108,58.5 112,54.5 119,54.5 120.5,53 120.5,52 AND1.5 120.5,51.5 120.5,51 102.5,33 v99.5,33
  Bottom 1.016: B.1 SENSOR3.3 13.5,81.5 12.5,81.5 10.5,79.5 10.5,73.5 | 10.5,73.5 10.5,67.5 12,66 14,66 SENSOR1.3 14.5,65.5 15.5,65.5 17.5,63.5 17.5,55 15.5,55 | 10.5,73.5 14,73.5 SENSOR2.3 | SERVO2.2 23,47 | 23,47 40,47 IC1.16 | 23,47 23,46.5 15.5,39 SERVO1.2 12.5,39 10.5,37 10.5,28.5 14,28.5 ENABLE.1 | 15.5,55 SERVO3.2 | 15.5,55 23,47.5 23,47 | v99.5,33 92,33 ESP-CAM.P$1 91.5,33 80,33 v78,31 | 15.5,13.5 14,13.5 TERMINAL3.2 | 16.75,12.25 20,9 SERIAL.4 | 16.75,12.25 15.5,13.5 | 15.5,19.5 14,19.5 TERMINAL2.2 | 15.5,19.5 17.5,17.5 17.5,14 15.5,14 15.5,13.5 | ARDUINO_PINS.1 56.5,9 56.5,12.5 17,12.5 16.75,12.25 | TERMINAL1.2 14,25.5 15.5,25.5 17.5,23.5 17.5,20 15.5,20 15.5,19.5